# Altium project 12v to 5v_Regulator.PrjPcb
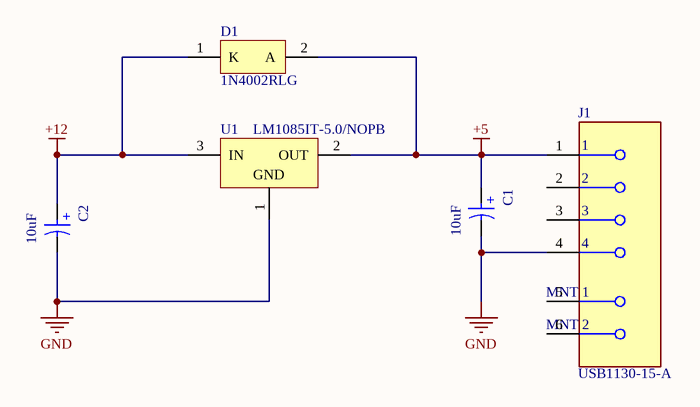
[diagram p0: Sheet1.SchDoc]
1 sheet, 5 parts. Net scope: global (net labels, ports and power ports of the same name join across sheets).
Board file: 12v to 5v_Regulator.PcbDoc

## Sheet Sheet1.SchDoc
size A; SheetNumber: 1; SheetTotal: 1

### Parts
C1  10uF  [WCAP-ASLI_D4H5.5]
C2  10uF  [WCAP-ASLI_D4H5.5]
D1  1N4002RLG  [ONSC-AXIAL_LEAD-2-59-10_P]
J1  USB1130-15-A  [FP-USB1130-15-A-MFG]
U1  LM1085IT-5.0/NOPB  [NDE0003A]

### Nets
+5: C1.1(P) D1.2(A) J1.1 U1.2(OUT)
+12: C2.1(P) D1.1(K) U1.3(IN)
GND: C1.2(N) C2.2(N) J1.4 U1.1(GND)

Not connected (* = marked no-connect by the designer): J1 2 3 5(MNT_1) 6(MNT_2)

### Notes on the sheet
- (in symbol CMP-03913-53914566-2) +

### Library data of the parts
C1 C2 = CMP-03913-53914566-2: WCAP-ASLI Aluminum Electrolytic Capacitors; Ripple Current: 80mA; Voltage Rating (DC): 16V; Impedance: 2.2Ω; Tolerance: 20%; ESR (Equivalent Series Resistance): 1.66693Ω; Polarity: Polar; Leakage Current: 3µA; Capacitance: 10µF; Life (Hours): 2000hours; Insulation Resistance: 5.33333MΩ; Mount: Surface Mount; RoHS: Compliant; Ripple Current (AC): 80mA; REACH SVHC: Unknown; Lead Free: Lead Free; Max Operating Temperature: 105°C; Case/Package: Radial; Diameter: 4mm; Min Operating Temperature: -55°C; Length: 5.5mm; Width: 4.3mm; Height - Seated (Max): 5.5118mm; Voltage Rating: 16V; Height: 5.5mm
D1 = CMP-0902-00183-1: Standard Recovery Rectifier, 2-Pin Axial_Lead, Pb-Free, Tape and Reel; Manufacturer: On Semiconductor; IO(rec) Max (A): 1; VRRM Max (V): 100; IFSM Max (A): 30; DatasheetVersion: Rev. 13; RoHS: TRUE; Packing: Tape and Reel; PackageVersion: Rev. U, 02/2005; ComponentLink3Description: Package Specification; ComponentLink1Description: Manufacturer URL; ComponentLink2Description: Datasheet; ComponentLink3URL: http://www.onsemi.cn/pub_link/Collateral/59-10.PDF; PackageDescription: 2-Pin, Axial Lead, Diameter 2.35 mm; PackageReference: AXIAL_LEAD-2-59-10; ComponentLink2URL: http://www.onsemi.com/pub_link/Collateral/1N4001-D.PDF; ComponentLink1URL: http://www.onsemi.com/; Mounting Technology: Through Hole; PartNumber: 1N4002RLG; Type: Standard Recovery
J1 = CMP-03329-113685452-1: USB1130-15-A USB Connectors USB A 2.0 Skt RA High Life 15u T Hole W/Shell Stake T & R; Number of Contacts: 4; Voltage Rating: 30V; Current Rating: 3A; USB Standard: USB 2.0; Height: 7.24mm; Min Operating Temperature: -40°C; Max Operating Temperature: 85°C; NexarPartId: 113685452; Contact Material: Gold, Nickel
U1 = CMP-0062-02541-3: 3A Low Dropout Positive Regulators, 3-pin TO-220, Pb-Free; Manufacturer: Texas Instruments; CompType: LDO IC; PowerWise: N; PackageTopMarking: NSUZXYTTE#*LM1085*IT-5.0; ComponentLink1Description: Datasheet URL; PinCount: 3; PackageDescription: TO-220, Molded, 3 Lead, Straight; ComponentLink1URL: http://www.ti.com/general/docs/lit/getliterature.tsp?genericPartNumber=LM1085&fileType=pdf; RoHS: Y; PackageReference: NDE0003A